# EAGLE design Schemat (EAGLE 9.6.0)
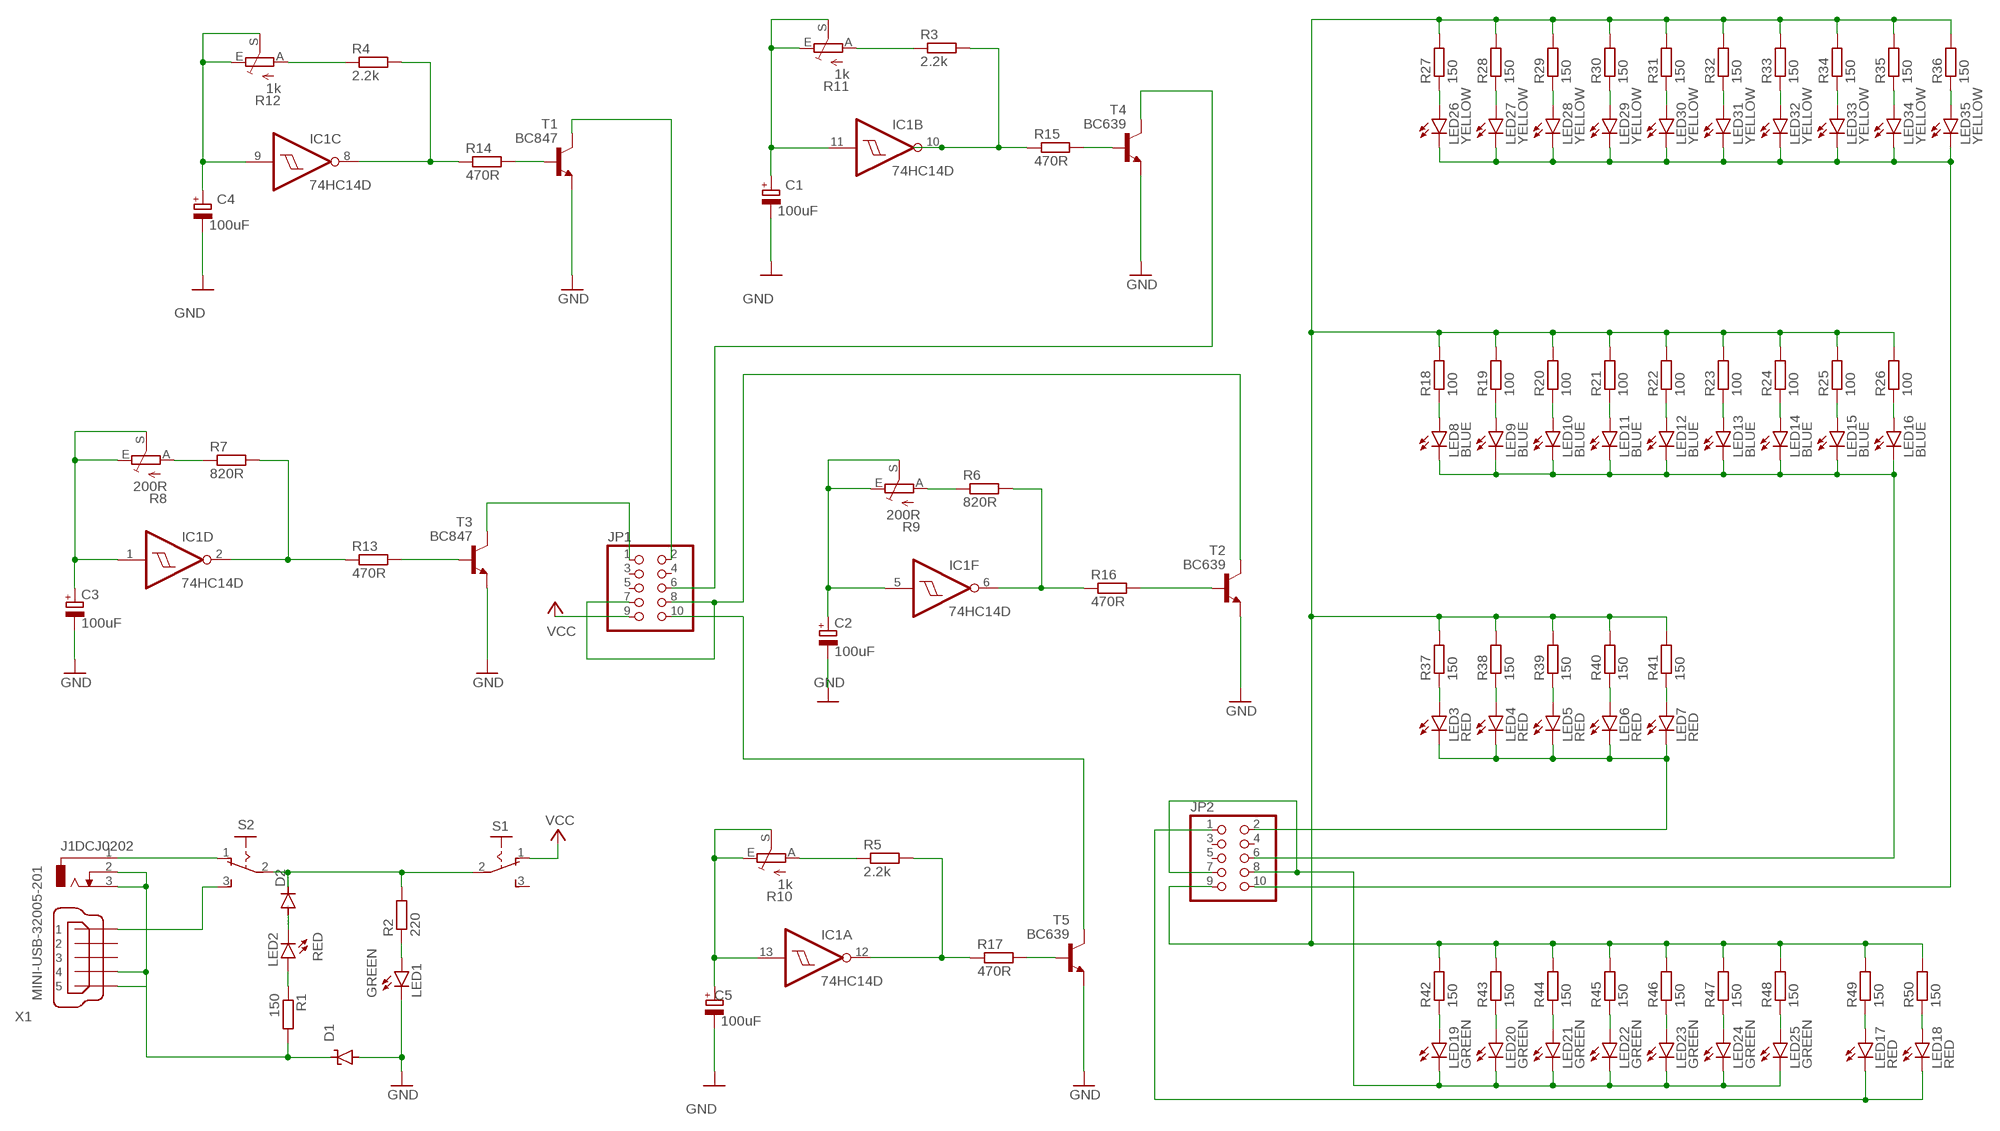
[diagram p0: schematic, sheet 1]

## Parts
C1  100uF  CPOL-EUE2.5-6  [E2,5-6]
C2  100uF  CPOL-EUE2.5-6  [E2,5-6]
C3  100uF  CPOL-EUE2.5-6  [E2,5-6]
C4  100uF  CPOL-EUE2.5-6  [E2,5-6]
C5  100uF  CPOL-EUE2.5-6  [E2,5-6]
D1  SUPPRESSOR-SMBJ  [SMBJ]
D2  DIODE-DO214AC  [DO214AC]
IC1  74HC14D  [SO14]
J1  DCJ0202  [DCJ0202]
JP1  PINHD-2X5  [2X05]
JP2  PINHD-2X5/90  [2X05/90]
LED1  GREEN  LED3MM  [LED3MM]
LED2  RED  LED5MM  [LED5MM]
LED3  RED  LED5MM  [LED5MM]
LED4  RED  LED5MM  [LED5MM]
LED5  RED  LED5MM  [LED5MM]
LED6  RED  LED5MM  [LED5MM]
LED7  RED  LED5MM  [LED5MM]
LED8  BLUE  LED5MM  [LED5MM]
LED9  BLUE  LED5MM  [LED5MM]
LED10  BLUE  LED5MM  [LED5MM]
LED11  BLUE  LED5MM  [LED5MM]
LED12  BLUE  LED5MM  [LED5MM]
LED13  BLUE  LED5MM  [LED5MM]
LED14  BLUE  LED5MM  [LED5MM]
LED15  BLUE  LED5MM  [LED5MM]
LED16  BLUE  LED5MM  [LED5MM]
LED17  RED  LED5MM  [LED5MM]
LED18  RED  LED5MM  [LED5MM]
LED19  GREEN  LED3MM  [LED3MM]
LED20  GREEN  LED3MM  [LED3MM]
LED21  GREEN  LED3MM  [LED3MM]
LED22  GREEN  LED3MM  [LED3MM]
LED23  GREEN  LED3MM  [LED3MM]
LED24  GREEN  LED3MM  [LED3MM]
LED25  GREEN  LED3MM  [LED3MM]
LED26  YELLOW  LED5MM  [LED5MM]
LED27  YELLOW  LED5MM  [LED5MM]
LED28  YELLOW  LED5MM  [LED5MM]
LED29  YELLOW  LED5MM  [LED5MM]
LED30  YELLOW  LED5MM  [LED5MM]
LED31  YELLOW  LED5MM  [LED5MM]
LED32  YELLOW  LED5MM  [LED5MM]
LED33  YELLOW  LED5MM  [LED5MM]
LED34  YELLOW  LED5MM  [LED5MM]
LED35  YELLOW  LED5MM  [LED5MM]
R1  150  R-EU_R0805  [R0805]
R2  220  R-EU_R0805  [R0805]
R3  2.2k  R-EU_R1206  [R1206]
R4  2.2k  R-EU_R1206  [R1206]
R5  2.2k  R-EU_R1206  [R1206]
R6  820R  R-EU_R1206  [R1206]
R7  820R  R-EU_R1206  [R1206]
R8  200R  TRIM_EU-CA6V  [CA6V]
R9  200R  TRIM_EU-CA6V  [CA6V]
R10  1k  TRIM_EU-CA6V  [CA6V]
R11  1k  TRIM_EU-CA6V  [CA6V]
R12  1k  TRIM_EU-CA6V  [CA6V]
R13  470R  R-EU_R1206  [R1206]
R14  470R  R-EU_R1206  [R1206]
R15  470R  R-EU_R1206  [R1206]
R16  470R  R-EU_R1206  [R1206]
R17  470R  R-EU_R1206  [R1206]
R18  100  R-EU_R0805  [R0805]
R19  100  R-EU_R0805  [R0805]
R20  100  R-EU_R0805  [R0805]
R21  100  R-EU_R0805  [R0805]
R22  100  R-EU_R0805  [R0805]
R23  100  R-EU_R0805  [R0805]
R24  100  R-EU_R0805  [R0805]
R25  100  R-EU_R0805  [R0805]
R26  100  R-EU_R0805  [R0805]
R27  150  R-EU_R0805  [R0805]
R28  150  R-EU_R0805  [R0805]
R29  150  R-EU_R0805  [R0805]
R30  150  R-EU_R0805  [R0805]
R31  150  R-EU_R0805  [R0805]
R32  150  R-EU_R0805  [R0805]
R33  150  R-EU_R0805  [R0805]
R34  150  R-EU_R0805  [R0805]
R35  150  R-EU_R0805  [R0805]
R36  150  R-EU_R0805  [R0805]
R37  150  R-EU_R0805  [R0805]
R38  150  R-EU_R0805  [R0805]
R39  150  R-EU_R0805  [R0805]
R40  150  R-EU_R0805  [R0805]
R41  150  R-EU_R0805  [R0805]
R42  150  R-EU_R0805  [R0805]
R43  150  R-EU_R0805  [R0805]
R44  150  R-EU_R0805  [R0805]
R45  150  R-EU_R0805  [R0805]
R46  150  R-EU_R0805  [R0805]
R47  150  R-EU_R0805  [R0805]
R48  150  R-EU_R0805  [R0805]
R49  150  R-EU_R0805  [R0805]
R50  150  R-EU_R0805  [R0805]
S1  M251  [M251]
S2  M251  [M251]
T1  BC847  [SOT23]
T2  BC639  BC639-NPN-TO92-ECB  [TO92-ECB]
T3  BC847  [SOT23]
T4  BC639  BC639-NPN-TO92-ECB  [TO92-ECB]
T5  BC639  BC639-NPN-TO92-ECB  [TO92-ECB]
X1  MINI-USB-32005-201  [32005-201]

## Nets
GND: C1.- C2.- C3.- C4.- C5.- D1.A LED1.K(C) T1.2(E) T2.E T3.2(E) T4.E T5.E
N$1: JP2.2 LED3.K(C) LED4.K(C) LED5.K(C) LED6.K(C) LED7.K(C)
N$2: JP2.6 LED8.K(C) LED9.K(C) LED10.K(C) LED11.K(C) LED12.K(C) LED13.K(C) LED14.K(C) LED15.K(C) LED16.K(C)
N$3: D2.A LED2.K(C)
N$4: LED2.A R1.1
N$5: JP2.9 R18.2 R19.2 R20.2 R21.2 R22.2 R23.2 R24.2 R25.2 R26.2 R27.2 R28.2 R29.2 R30.2 R31.2 R32.2 R33.2 R34.2 R35.2 R36.2 R37.2 R38.2 R39.2 R40.2 R41.2 R42.2 R43.2 R44.2 R45.2 R46.2 R47.2 R48.2 R49.2 R50.2
N$6: JP2.10 LED26.K(C) LED27.K(C) LED28.K(C) LED29.K(C) LED30.K(C) LED31.K(C) LED32.K(C) LED33.K(C) LED34.K(C) LED35.K(C)
N$7: JP2.1 LED17.K(C) LED18.K(C)
N$8: JP2.7 JP2.8 LED19.K(C) LED20.K(C) LED21.K(C) LED22.K(C) LED23.K(C) LED24.K(C) LED25.K(C)
N$9: LED3.A R37.1
N$10: LED21.A R44.1
N$11: LED22.A R45.1
N$12: LED23.A R46.1
N$13: LED24.A R47.1
N$14: LED25.A R48.1
N$15: LED19.A R42.1
N$16: LED20.A R43.1
N$18: LED7.A R41.1
N$19: LED6.A R40.1
N$20: LED5.A R39.1
N$21: LED4.A R38.1
N$22: D1.C J1.2 J1.3 R1.2 X1.4 X1.5
N$23: LED8.A R18.1
N$24: LED9.A R19.1
N$25: LED10.A R20.1
N$26: LED11.A R21.1
N$27: LED12.A R22.1
N$28: LED13.A R23.1
N$29: LED14.A R24.1
N$30: LED15.A R25.1
N$31: LED16.A R26.1
N$32: JP1.2 T1.3(C)
N$33: LED18.A R50.1
N$34: LED17.A R49.1
N$35: D2.C R2.2 S1.2(P) S2.2(P)
N$36: LED27.A R28.1
N$37: LED28.A R29.1
N$38: LED29.A R30.1
N$39: LED30.A R31.1
N$40: LED31.A R32.1
N$41: LED32.A R33.1
N$42: LED33.A R34.1
N$43: LED34.A R35.1
N$44: LED35.A R36.1
N$46: LED26.A R27.1
N$47: C1.+ IC1.11(B:I) R11.E R11.S
N$48: R3.1 R11.A
N$49: C4.+ IC1.9(C:I) R12.E R12.S
N$50: R15.2 T4.B
N$51: IC1.10(B:O) R3.2 R15.1
N$52: R4.1 R12.A
N$53: R14.2 T1.1(B)
N$54: IC1.8(C:O) R4.2 R14.1
N$55: C5.+ IC1.13(A:I) R10.E R10.S
N$56: R5.1 R10.A
N$57: R17.2 T5.B
N$58: IC1.12(A:O) R5.2 R17.1
N$59: R6.1 R9.A
N$60: R7.1 R8.A
N$61: IC1.2(D:O) R7.2 R13.1
N$62: R13.2 T3.1(B)
N$63: C3.+ IC1.1(D:I) R8.E R8.S
N$64: IC1.6(F:O) R6.2 R16.1
N$65: R16.2 T2.B
N$66: C2.+ IC1.5(F:I) R9.E R9.S
N$67: LED1.A R2.1
N$68: JP1.10 T5.C
N$69: J1.1 S2.1(O)
N$71: S2.3(S) X1.1
N$74: JP1.6 T4.C
N$77: JP1.1 T3.3(C)
N$83: JP1.7 JP1.8 T2.C
VCC: JP1.9 S1.1(O)
Unconnected: IC1.3(E:I) IC1.4(E:O) JP1.3 JP1.4 JP1.5 JP2.3 JP2.4 JP2.5 S1.3(S) X1.2 X1.3

## Power pins joined to a net without a drawn wire
GND: IC1.7(P:GND)
VCC: IC1.14(P:VCC)

## Library data of the parts
C1-C5 = rcl:CPOL-EU: POLARIZED CAPACITOR, European symbol; SPICEPREFIX: C
D1 = diode:SUPPRESSOR-: Suppressor diode
D2 = diode:DIODE-: DIODE
IC1 = 74xx-eu:74*14: Hex schmitt trigger INVERTER
J1 = con-jack:DCJ0202: DC POWER JACK Source: DCJ0202.pdf; OC_FARNELL: unknown; OC_NEWARK: unknown
JP1 JP2 = pinhead:PINHD-2X5: PIN HEADER
LED1-LED35 = led:LED: LED OSRAM: - CHIPLED LG R971, LG N971, LY N971, LG Q971, LY Q971, LO R971, LY R971 LH N974, LH R974 LS Q976, LO Q976, LY Q976 LO Q996 - Hyper CHIPLED LW Q18S LB Q993, LB Q99A, LB R99A - SideLED LS A670, LO A670, LY A670, LG A670, LP A670 LB A673, LV A673, LT A673, LW A673 LH A674 LY A675 LS A676, LA A676, LO A676, LY A676, LW A676 LS A679, LY A679, LG A679 - Hyper Micro SIDELED® LS Y876, LA Y876, LO Y876, LY Y876 LT Y87S - SmartLED LW L88C, LW L88S LB L89C, LB L89S, LG L890 LS L89K, LO L89K, LY L89K LS L896, LA L896, LO L896, LY L896 - TOPLED LS T670, LO T670, LY T670, LG T670, LP T670 LSG T670, LSP T670, LSY T670, LOP T670, LYG T670 LG T671, LOG T671, LSG T671 LB T673, LV T673, LT T673, LW T673 LH T674 LS T676, LA T676, LO T676, LY T676, LB T676, LH T676, LSB T676, LW T676 LB T67C, LV T67C, LT T67C, LS T67K, LO T67K, LY T67K, LW E67C LS E67B, LA E67B, LO E67B, LY E67B, LB E67C, LV E67C, LT E67C LW T67C LS T679, LY T679, LG T679 LS T770, LO T770, LY T770, LG T770, LP T770 LB T773, LV T773, LT T773, LW T773 LH T774 LS E675, LA E675, LY E675, LS T675 LS T776, LA T776, LO T776, LY T776, LB T776 LHGB T686 LT T68C, LB T68C - Hyper Mini TOPLED® LB M676 - Mini TOPLED Santana® LG M470 LS M47K, LO M47K, LY M47K Source: http://www.osram.convergy.de LUXEON: - LUMILED® LXK2-PW12-R00, LXK2-PW12-S00, LXK2-PW14-U00, LXK2-PW14-V00 LXK2-PM12-R00, LXK2-PM12-S00, LXK2-PM14-U00 LXK2-PE12-Q00, LXK2-PE12-R00, LXK2-PE12-S00, LXK2-PE14-T00, LXK2-PE14-U00 LXK2-PB12-K00, LXK2-PB12-L00, LXK2-PB12-M00, LXK2-PB14-N00, LXK2-PB14-P00, LXK2-PB14-Q00 LXK2-PR12-L00, LXK2-PR12-M00, LXK2-PR14-Q00, LXK2-PR14-R00 LXK2-PD12-Q00, LXK2-PD12-R00, LXK2-PD12-S00 LXK2-PH12-R00, LXK2-PH12-S00 LXK2-PL12-P00, LXK2-PL12-Q00, LXK2-PL12-R00 Source: www.luxeon.com KINGBRIGHT: KA-3528ASYC Source: www.kingbright.com
R1-R7 R13-R50 = rcl:R-EU_: RESISTOR, European symbol; SPICEPREFIX: R
R8-R12 = pot:TRIM_EU-: POTENTIOMETER
S1 S2 = switch:M251: SLIDING SWITCH Mors, distributor Buerklin, 11G702
T1 T3 = transistor:BC847: NPN TRANSISTOR
T2 T4 T5 = transistor:*-NPN-: NPN Transistror BF959 corrected 2008.03.06
X1 = con-cypressindustries:MINI-USB-: MINI USB-B Conector Source: www.cypressindustries.com; OC_FARNELL: unknown; OC_NEWARK: unknown

## Board
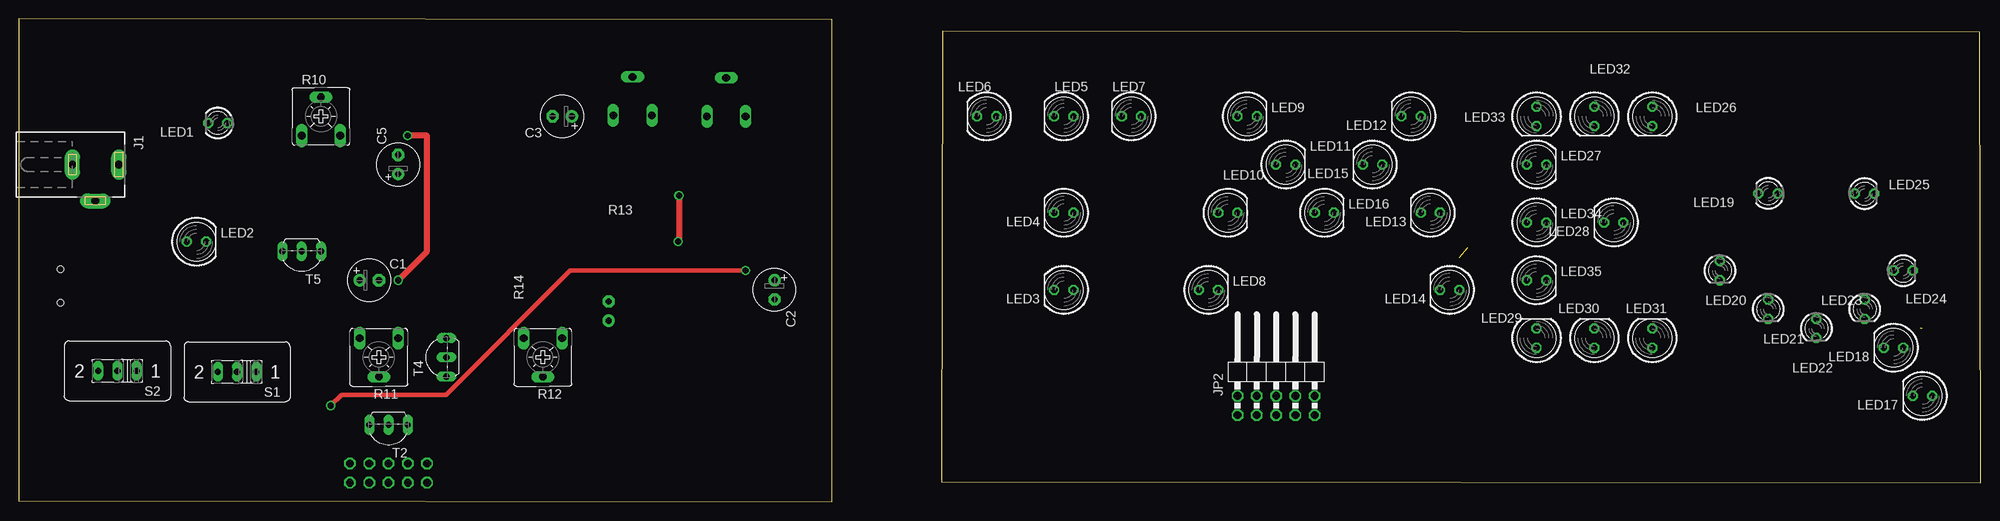
[diagram p1: board, top side]
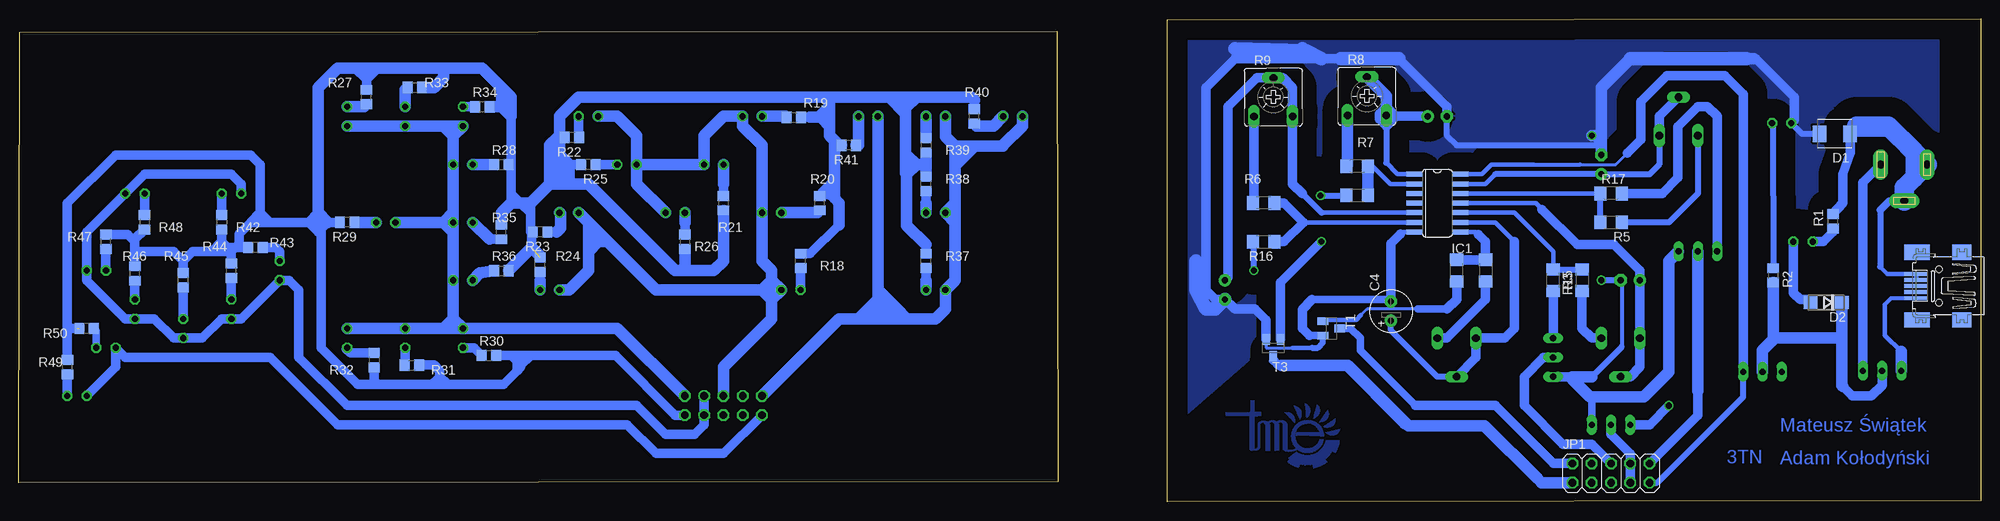
[diagram p2: board, bottom side, seen from below]

Size 258.21 x 63.63 mm. Coordinates in mm from the lower left corner, seen from the top.
Outline: 121.41,2.67 258.21,2.54 258.08,61.9 121.54,62.03 121.41,2.67
Outline: 0,63.63 0,0.13 107.06,0 107.06,63.5 0,63.63
Copper layers (1*16): Top 0.035mm / dielectric 1.5mm / Bottom 0.035mm
Design rules "default": minimum track width 6mil, minimum drill 0.35mm, track to track 6mil, track to pad 6mil, pad to pad 6mil, via to via 6mil, smd to smd 6mil, copper to edge 40mil, drill to drill 6mil, minimum pad ring 10mil, minimum via ring 8mil, stop-mask expansion 4mil, vias tented up to drill 0mil, thermal gap 10mil

### Footprints (pad centres in the part's own frame; a part is rotated, then mirrored left to right if it is on the bottom)
E2,5-6 = drill 0.813 pad 1.6: + -1.27,0 | drill 0.813 pad 1.6 octagon: - 1.27,0
SMBJ = smd 1.78 x 2.16: A 2.04,0; C -2.03,0
DO214AC = smd 1.8 x 1.7: A 2.05,0; C -2.05,0
SO14 = smd 0.66 x 2.032: 1 -3.81,-3.073; 2 -2.54,-3.073; 3 -1.27,-3.073; 4 0,-3.073; 5 1.27,-3.073; 6 2.54,-3.073; 7 3.81,-3.073; 8 3.81,3.073; 9 2.54,3.073; 10 1.27,3.073; 11 0,3.073; 12 -1.27,3.073; 13 -2.54,3.073; 14 -3.81,3.073
DCJ0202 = drill 1 pad 2 long: 1 0,3.1; 2 4.8,0; 3 0,-3
2X05 = drill 1.016 octagon: 1 -5.08,-1.27; 2 -5.08,1.27; 3 -2.54,-1.27; 4 -2.54,1.27; 5 0,-1.27; 6 0,1.27; 7 2.54,-1.27; 8 2.54,1.27; 9 5.08,-1.27; 10 5.08,1.27
2X05/90 = drill 1.016 octagon: 1 -5.08,-6.35; 2 -5.08,-3.81; 3 -2.54,-6.35; 4 -2.54,-3.81; 5 0,-6.35; 6 0,-3.81; 7 2.54,-6.35; 8 2.54,-3.81; 9 5.08,-6.35; 10 5.08,-3.81
LED3MM = drill 0.813 octagon: A -1.27,0; K 1.27,0
LED5MM = drill 0.813 octagon: A -1.27,0; K 1.27,0
R0805 = smd 1.3 x 1.5: 1 -0.95,0; 2 0.95,0
R1206 = smd 1.6 x 1.803: 1 -1.422,0; 2 1.422,0
CA6V = drill 1.016 long: A -2.54,-2.54; E 2.54,-2.54; S 0,2.54
M251 = drill 0.813 long: 1 -2.54,0; 2 0,0; 3 2.54,0
SOT23 = smd 1 x 1.4: 1 -0.95,-1.1; 2 0.95,-1.1; 3 0,1.1
TO92-ECB = drill 0.813 long: B 2.54,0; C 0,0; E -2.54,0
32005-201 = smd 3.1 x 0.5: 1 3,1.6; 2 3,0.8; 3 3,0; 4 3,-0.8; 5 3,-1.6 | smd 2.5 x 2: M1 -3,-4.45; M2 -3,4.45 | smd 3.3 x 2: M3 2.9,4.45; M4 2.9,-4.45 | hole 0.9: 0,2.2; 0,-2.2

### Placement (x,y rotation side)
C1  46.1,29.21 0 top
C2  99.44,27.94 270 top
C3  71.5,50.8 180 top
C4  77.6,25.15 90 bottom
C5  49.91,44.45 90 top
D1  19.18,48.51 180 bottom
D2  20.32,26.29 180 bottom
IC1  71.5,39.37 270 bottom
J1  10.03,44.45 270 top
JP1  48.64,3.81 0 bottom
JP2  165.48,17.78 0 top
LED1  26.16,49.91 180 top
LED2  23.37,34.29 0 top
LED3  137.54,27.94 180 top
LED4  137.54,38.1 180 top
LED5  137.54,50.8 180 top
LED6  127.38,50.8 180 top
LED7  146.43,50.8 180 top
LED8  156.59,27.94 0 top
LED9  161.67,50.8 0 top
LED10  159.13,38.1 0 top
LED11  166.75,44.45 0 top
LED12  183.26,50.8 180 top
LED13  185.8,38.1 180 top
LED14  188.34,27.94 180 top
LED15  178.18,44.45 180 top
LED16  171.83,38.1 0 top
LED17  250.57,13.97 180 top
LED18  246.76,20.32 180 top
LED19  230.25,40.64 180 top
LED20  223.9,30.48 270 top
LED21  230.25,25.4 270 top
LED22  236.6,22.86 270 top
LED23  242.95,25.4 270 top
LED24  248.03,30.48 0 top
LED25  242.95,40.64 0 top
LED26  215.01,50.8 270 top
LED27  199.77,44.45 0 top
LED28  209.93,36.83 180 top
LED29  199.77,21.59 90 top
LED30  207.39,21.59 90 top
LED31  215.01,21.59 90 top
LED32  207.39,50.8 270 top
LED33  199.77,50.8 270 top
LED34  199.77,36.83 0 top
LED35  199.77,29.21 0 top
R1  19.43,36.96 90 bottom
R2  27.31,29.84 270 bottom
R3  52.45,29.21 90 bottom
R4  65.15,30.48 90 bottom
R5  48.64,36.83 180 bottom
R6  94.36,39.37 0 bottom
R7  82.04,44.2 0 bottom
R8  80.77,53.47 0 bottom
R9  93.09,53.34 0 bottom
R10  39.75,50.8 0 top
R11  47.37,19.05 180 top
R12  68.96,19.05 180 top
R13  82.04,40.39 180 bottom
R14  68.96,30.48 270 bottom
R15  56.26,29.21 270 bottom
R16  94.36,34.29 180 bottom
R17  48.64,40.64 0 bottom
R18  155.32,31.75 90 bottom
R19  156.21,50.67 0 bottom
R20  152.78,39.37 90 bottom
R21  165.48,39.37 270 bottom
R22  185.42,48.01 180 bottom
R23  189.61,35.56 180 bottom
R24  189.61,31.24 90 bottom
R25  183.26,44.45 180 bottom
R26  170.56,34.29 270 bottom
R27  212.47,53.34 90 bottom
R28  194.69,44.45 0 bottom
R29  215.01,36.83 180 bottom
R30  196.34,19.3 0 bottom
R31  206.5,18.03 0 bottom
R32  211.45,18.67 270 bottom
R33  206.12,54.61 0 bottom
R34  197.23,52.07 0 bottom
R35  194.69,35.56 90 bottom
R36  194.69,30.48 0 bottom
R37  138.81,31.75 90 bottom
R38  138.81,41.91 90 bottom
R39  138.81,46.99 270 bottom
R40  132.46,50.8 90 bottom
R41  148.97,46.99 180 bottom
R42  231.52,36.83 270 bottom
R43  227.08,33.53 180 bottom
R44  230.25,30.48 90 bottom
R45  236.6,29.21 90 bottom
R46  242.95,30.1 90 bottom
R47  246.76,34.29 90 bottom
R48  241.68,36.83 270 bottom
R49  251.84,17.78 90 bottom
R50  249.3,22.86 180 bottom
S1  28.7,17.14 180 top
S2  12.95,17.27 180 top
T1  85.47,22.86 270 bottom
T2  48.64,10.16 180 top
T3  93.09,20.32 180 bottom
T4  56.26,19.05 90 top
T5  37.21,33.02 180 top
X1  5.46,28.45 180 bottom

### Tracks (layer width: path | path; a pad name or v marks a point on that pad's centre or on a via)
GND  (via drill 0.8)
  Top 0.813: v49.91,29.21 53.72,33.02 53.72,48.26 v51.18,48.26
  Bottom 0.406: T3.2 94.04,20.32 90.55,20.32
  Bottom 0.508: C1.- 47.24,29.08 47.24,20.45
  Bottom 0.61: 76.34,35.32 76.1,35.56 IC1.7 | 90.55,20.32 88.01,20.32
  Bottom 0.813: 49.91,46.99 68.96,46.99 70.23,48.26 C3.- | 51.18,16.51 47.24,20.45 | 41.02,20.32 41.02,19.81 | C1.- v49.91,29.21 | v51.18,48.26 49.91,46.99 | 49.91,46.99 C5.- | LED1.K 23.5,48.51 D1.A | 88.01,20.32 87.25,20.32 86.57,21 T1.2
  Bottom 1.016: T2.E 51.18,13.84 | 77.85,26.67 88,26.67 | 88.33,21.91 T1.2
  Bottom 1.27: T3.2 94.04,23.96 95.48,25.4 98.17,25.4 C2.- 100.71,26.67 101.98,27.94 101.98,54.61 98.17,58.42 86.74,58.42 84.2,58.42 | C3.- 70.23,52.07 76.58,58.42 | 76.34,35.32 77.6,34.06 C4.- 77.85,26.67 | 30.86,58.42 29.59,58.42 24.51,53.34 24.51,50.29 LED1.K | 88,26.67 89.28,25.39 89.28,22.86 88.33,21.91 | T4.E 53.72,16.51
  Bottom 1.524: 51.18,16.51 53.72,16.51 53.72,16.13 51.43,13.84 51.18,13.84 44.32,13.84 41.02,17.14 41.02,19.81 | T5.E 41.02,31.75 41.02,20.32 | 29.84,58.42 30.86,58.42 | 46.1,58.42 49.91,54.61 49.91,48.26 | 49.91,48.26 C5.- | 49.91,48.26 v51.18,48.26
  Bottom 1.778: 46.1,58.42 30.86,58.42 | 76.58,58.42 84.2,58.42 | 86.74,58.42 88.77,59.44 | 88.77,59.44 89.28,59.69 | 88.77,59.44 98.17,59.69 | C2.- 100.71,25.4 101.98,25.4 103.25,27.94 103.25,31.75
  pour Bottom (isolate 2.54): 19.43,52.07 9.27,52.07 5.46,48.26 5.46,60.96 104.52,60.96 104.52,11.43 94.36,20.32 94.36,27.94 100.71,27.94 100.71,46.99 19.43,38.1 18.16,50.8
N$1
  Bottom 1.524: LED7.K 145.16,27.94 | 135,46.85 135,44.45 | 135,44.45 135,39.37 | 135,39.37 LED4.K 135,36.83 | LED6.K 126.11,49.53 128.65,46.99 | 128.65,46.99 128.65,46.85 | 128.65,46.99 128.79,46.85 132.46,46.85 | 132.46,46.85 135,46.85 | 135,36.83 135,29.21 LED3.K 136.27,25.4 137.54,24.13 141.35,24.13 | 141.35,24.13 142.62,25.4 | 142.62,25.4 143.89,26.67 | 143.89,26.67 145.16,27.94 | 135,36.83 135,39.37 | 135,46.85 136.27,48.12 LED5.K | 132.46,46.85 134.86,44.45 135,44.45 | JP2.2 150.24,24.13 147.7,24.13 | 147.7,24.13 145.16,24.13 | 145.16,24.13 141.35,24.13 | 145.16,27.94 145.16,26.67 147.7,24.13 | 143.89,26.67 145.16,25.4 145.16,24.13 | 142.62,25.4 143.89,25.4 145.16,24.13
N$2
  Bottom 1.524: LED16.K 176.91,41.91 LED15.K | LED12.K 179.45,50.8 176.91,48.26 LED15.K | LED15.K LED11.K 168.02,48.26 165.48,50.8 LED9.K 162.94,49.53 160.4,46.99 LED10.K 160.4,31.75 159.13,30.48 159.13,29.21 | LED8.K 159.13,29.21 | LED8.K 159.13,27.94 | 159.13,27.94 160.4,27.94 | 160.4,27.94 174.37,27.94 180.72,34.29 | 159.13,29.21 160.4,27.94 | 180.72,34.29 183.26,36.83 | 183.26,36.83 LED13.K | 183.26,34.29 183.26,33.02 | LED14.K 185.8,27.94 183.26,30.48 183.26,33.02 | 183.26,34.29 181.99,34.29 | 181.99,34.29 180.72,34.29 | 181.99,34.29 183.26,33.02 | 183.26,34.29 183.26,36.83 | 159.13,27.94 159.13,26.67 | 159.13,26.67 159.13,24.13 165.48,17.78 JP2.6 | 160.4,27.94 159.13,26.67 | LED8.K 159.13,26.67
N$3
  Bottom 1.27: D2.A 22.75,26.67 23.75,26.67 24.64,27.56 LED2.K
N$4
  Bottom 1.27: LED2.A 20.7,34.29 19.43,35.56 R1.1
N$5  (2 unrouted)
  Bottom 0.61: 208.66,57.15 204.85,57.15 | 204.85,57.15 204.7,57 | 204.85,57.15 202.31,57.15 | 230.65,31.5 R44.2
  Bottom 1.27: R35.2 194.69,38.1 | 190.88,38.1 190.88,35.56 R23.2 190.75,35.37 190.75,33.53 | 190.88,38.1 190.88,39.37 | 190.88,38.1 192.15,39.37 193.42,40.64 | R25.2 185.8,44.45 | R22.2 187.32,48.01 | R40.2 132.46,52.96 | R39.2 138.81,45.72 | R38.2 138.81,43.18 | R37.2 138.81,33.91 | R20.2 152.46,40.64 | R19.2 154.05,50.67 | R26.2 170.56,33.02 | R24.2 189.61,32.38 | 193.42,50.8 193.42,44.45 R28.2 193.42,44.13 193.42,40.64 | 193.42,40.64 193.42,39.37 | R33.2 204.85,54.61 | R34.2 195.96,52.07 | R27.2 212.47,55.88 | 217.55,36.83 R29.2 | 203.58,15.49 202.82,15.49 | 202.82,15.49 202.31,15.49 | 202.31,15.49 201.8,15.49 | R31.2 203.58,18.03 202.82,17.27 202.82,16.51 | 202.82,16 202.82,15.49 | 202.82,16.51 203.58,15.75 203.58,15.49 | 202.82,16 202.82,16.51 | 202.82,16 202.31,15.49 | 202.82,16.51 201.8,15.49 | 192.66,17.27 194.44,15.49 201.8,15.49 | 192.66,17.27 192.15,17.78 192.15,18.03 | 192.15,18.03 192.15,19.05 192.41,19.3 | R30.2 193.42,19.3 | 193.42,19.3 192.41,19.3 | 192.41,19.3 190.88,19.3 | 192.15,18.03 192.66,18.54 | 193.42,19.3 192.66,18.54 | 192.66,17.27 192.66,18.54 | 190.88,19.3 192.15,18.03 | JP2.9 171.83,11.43 179.7,19.3 190.88,19.3 | R46.2 242.95,33.02 | 242.95,33.02 242.95,34.29 | R45.2 236.6,31.75 | 236.6,31.75 237.87,33.02 242.95,33.02 | 236.6,31.75 235.33,33.02 232.79,33.02 | 232.79,33.02 231.52,34.29 | 231.52,34.29 R42.2 | 231.52,34.29 230.76,33.53 | 230.76,33.53 230.25,33.02 | 230.25,33.02 R44.2 | 230.25,33.02 232.79,33.02 | R43.2 229.74,33.53 | 230.76,33.53 229.74,33.53 | 229.74,33.53 230.25,33.02 | R47.2 243.9,35.24 242.95,34.29 | R49.2 251.84,22.86 | 251.84,22.86 250.57,22.86 | 251.84,22.86 251.84,39.37 245.49,45.72 227.71,45.72 226.44,44.45 226.44,38.1
  Bottom 1.27: 217.55,36.83 218.44,36.83 | 218.44,36.83 220.09,36.83 | 220.09,36.83 225.17,36.83 | 225.17,36.83 227.71,36.83 | 227.71,36.83 229.23,35.31 229.23,34.04 229.74,33.53 | 226.44,38.1 227.71,36.83 | 226.44,38.1 225.17,36.83 | R32.2 211.45,16 210.95,15.49 | 210.95,15.49 203.58,15.49 | 210.95,15.49 213.61,15.49 218.44,20.32 218.44,35.56 | 218.44,35.56 218.44,36.83 | 218.82,38.1 220.09,36.83 | 220.09,36.83 218.82,35.56 | 218.82,35.56 218.44,35.56 | 218.82,35.56 217.55,36.83 | R18.2 154.05,32.7 150.24,36.51 | 242.95,34.29 242.95,34.61 R48.2
  Bottom 1.524: 150.88,40.01 150.24,39.37 150.24,36.51 | 150.88,40.01 151.51,40.64 152.46,40.64 151.19,41.91 150.88,41.91 | 170.56,33.02 170.56,30.48 | 170.56,30.48 166.75,30.48 165.48,31.75 R21.2 | 170.56,30.48 171.83,30.48 183.22,41.87 185.8,41.87 | 185.8,41.87 188.3,41.87 | 187.07,48.26 187.32,48.01 188.34,46.99 | 188.34,46.99 188.34,44.45 | 188.34,44.45 188.34,41.91 188.3,41.87 | 187.07,44.45 185.8,44.45 | 187.07,44.45 188.34,44.45 | 187.07,44.45 187.07,43.18 185.8,43.18 | 185.8,43.18 185.8,41.87 | 185.8,43.18 185.8,44.45 | 185.8,44.45 187.07,45.72 | 187.07,45.72 187.71,46.35 | 187.71,46.35 188.34,46.99 | 187.07,46.99 187.07,48.26 | 187.71,46.35 187.07,46.99 | 187.07,45.72 187.07,46.99 | 188.3,41.87 188.38,41.87 190.88,39.37 192.15,39.37 193.42,39.37 194.69,38.1 | 189.61,32.38 190.72,33.5 R36.2 | 204.85,54.61 203.58,54.61 202.31,55.88 202.31,57.15 | 202.31,57.15 208.66,57.15 211.2,57.15 | 194.69,54.61 197.23,57.15 202.31,57.15 | 194.69,54.61 193.42,53.34 193.42,52.07 | 193.42,52.07 193.42,50.8 194.69,52.07 | 193.42,52.07 194.69,52.07 | 195.96,52.07 194.69,52.07 | 194.69,52.07 194.69,54.61 | 187.07,48.26 187.07,50.8 184.53,53.34 151.51,53.34 | 154.05,50.67 152.91,50.67 | 151.51,53.34 151.51,52.07 | 152.91,50.67 151.51,52.07 | R41.2 150.24,46.99 150.88,47.62 | 150.88,47.62 151.51,48.26 151.51,49.53 | 151.51,52.07 151.51,49.53 | 152.91,50.67 152.65,50.67 151.51,49.53 | 150.88,47.62 150.88,41.91 | 150.88,41.91 150.88,40.01 | 151.51,53.34 143.64,53.34 | 138.81,45.72 138.81,44.45 | 138.81,43.18 138.81,44.45 | 141.48,51.18 143.64,53.34 | 141.48,51.18 141.48,51.94 140.08,53.34 | 143.64,53.34 140.08,53.34 | 140.08,53.34 132.84,53.34 132.46,52.96
  Bottom 1.524: 141.35,43.18 140.08,44.45 | 141.35,43.18 141.48,43.31 141.48,45.72 | 141.48,45.72 141.48,51.18 | 138.81,44.45 140.08,44.45 | 140.08,44.45 141.35,45.72 141.48,45.72 | 141.35,43.18 141.35,36.45 138.81,33.91 | 217.55,36.83 218.82,38.1 218.82,54.61 216.28,57.15 213.74,57.15 | 213.74,57.15 212.47,57.15 | 212.47,57.15 211.2,57.15 | 212.47,57.15 212.47,55.88 | 212.47,55.88 213.74,57.15 | 212.47,55.88 211.2,57.15
N$6
  Bottom 0.61: LED29.K 201.04,22.86 202.31,22.86 LED30.K
  Bottom 1.524: 202.31,49.53 LED33.K 201.04,48.26 | 202.31,49.53 LED32.K LED26.K | 201.04,48.26 LED27.K 201.04,38.1 | 201.04,48.26 202.31,49.53 | 201.04,38.1 LED34.K | LED34.K 201.04,35.56 | 201.04,35.56 LED35.K 201.04,24.13 | LED28.K 202.31,36.83 | LED34.K 202.31,36.83 | 201.04,38.1 202.31,36.83 | 202.31,36.83 201.04,35.56 | 201.04,22.86 201.04,24.13 | LED29.K 201.04,24.13 | 201.04,24.13 202.31,22.86 | LED29.K LED30.K LED31.K | JP2.10 179.45,22.86 LED29.K
N$7
  Bottom 1.27: LED17.K 245.49,17.78 LED18.K 244.22,19.05 225.17,19.05 216.28,10.16 178.13,10.16 174.37,6.4 165.43,6.4 JP2.1
N$8
  Bottom 1.27: LED19.K 228.98,41.91 230.25,43.18 241.68,43.18 LED25.K 249.3,35.56 LED24.K 249.3,29.21 244.22,24.13 LED23.K 240.41,24.13 237.87,21.59 LED22.K 234.06,21.59 231.52,24.13 LED21.K 228.98,24.13 LED20.K 222.63,29.21 221.36,27.94 221.36,19.05 215.01,12.7 176.91,12.7 173.1,8.89 169.29,8.89 168.02,10.16 JP2.7 JP2.8
N$9
  Bottom 1.27: R37.1 138.81,29.21
  Bottom 1.524: 138.81,29.21 LED3.A
N$10
  Bottom 1.27: R44.1 LED21.A
N$11
  Bottom 1.27: R45.1 LED22.A
N$12
  Bottom 1.27: R46.1 LED23.A
N$13
  Bottom 1.27: R47.1 LED24.A
N$14
  Bottom 1.27: LED25.A R48.1
N$15
  Bottom 1.27: R42.1 LED19.A
N$16
  Bottom 1.27: R43.1 224.41,33.53 223.9,33.02 LED20.A
N$17
  pour Bottom (isolate 2.54): 1197 corners
N$18
  Bottom 1.524: LED7.A 147.7,46.99 R41.1
N$19
  Bottom 1.27: R40.1 132.14,49.53
  Bottom 1.524: 132.14,49.53 129.92,49.53 LED6.A
N$20
  Bottom 1.27: R39.1 138.81,48.26
  Bottom 1.524: 138.81,48.26 LED5.A
N$21
  Bottom 0.61: LED4.A 138.81,37.95
  Bottom 1.27: R38.1 138.81,39.37
  Bottom 1.524: 138.81,39.37 LED4.A
N$22
  Bottom 0.508: 13.21,30.99 12.27,30.05
  Bottom 0.61: 12.27,30.05 X1.5 X1.4
  Bottom 0.813: D1.C 12.37,48.51 8.3,44.45 J1.3 | 13.21,38.48 13.21,30.99
  Bottom 1.016: J1.2 12.04,39.65 13.21,38.48
  Bottom 1.27: R1.2 18.16,39.37 18.16,43.18 17.15,45.97 D1.C | 8.79,46.2 9.27,45.72 9.27,43.18 8.79,42.7
  Bottom 2.54: 16.26,49.53 12.11,49.53 8.79,46.2 J1.3 8.79,42.7 10.03,41.45 J1.2
N$23
  Bottom 1.27: R18.1 LED8.A
N$24
  Bottom 1.27: R19.1 157.29,50.8
  Bottom 1.524: 157.29,50.8 LED9.A
N$25
  Bottom 1.27: R20.1 153.1,38.1
  Bottom 1.524: 153.1,38.1 LED10.A
N$26
  Bottom 1.27: R21.1 165.48,41.91
  Bottom 1.524: LED11.A 165.48,41.91
N$27
  Bottom 1.27: LED12.A 184.53,48.07 R22.1
N$28
  Bottom 1.27: R23.1 187.45,35.56
  Bottom 1.524: 187.45,35.56 186.94,36.07 186.94,37.97 LED13.A
N$29
  Bottom 1.27: R24.1 189.61,29.21
  Bottom 1.524: 189.61,29.21 LED14.A
N$30
  Bottom 1.27: R25.1 LED15.A
N$31
  Bottom 1.27: R26.1 170.56,36.83
  Bottom 1.524: 170.56,36.83 LED16.A
N$32
  Bottom 1.016: 74.42,12.7 81.66,19.94 81.66,21.59 82.93,22.86 T1.3
  Bottom 1.27: 74.42,12.7 63.88,12.7 56.26,5.08 JP1.2
N$33
  Bottom 1.016: LED18.A 248.03,22.54 R50.1
N$34
  Bottom 1.27: R49.1 LED17.A
N$35
  Bottom 0.508: 17.53,14.61 16.89,13.97
  Bottom 0.61: D2.C 18.29,26.27 | 18.14,15.22 17.53,14.61 17.4,14.48
  Bottom 0.813: D2.C 18.14,26.16 | 28.68,17.14 S1.2 28.89,17.34
  Bottom 1.27: S2.2 12.95,15.37 14.35,13.97 16.89,13.97 18.14,15.22
  Bottom 1.524: 18.14,15.22 18.27,15.35 18.27,21.59 | 18.27,21.59 D2.C | S1.2 28.7,19.94 27.05,21.59 | 18.27,21.59 27.05,21.59 | 27.05,21.59 27.31,21.84 R2.2
N$36
  Bottom 1.27: R28.1 195.96,44.45
  Bottom 1.524: 195.96,44.45 LED27.A
N$37
  Bottom 1.27: R29.1 213.74,36.83
  Bottom 1.524: 213.74,36.83 LED28.A
N$38
  Bottom 1.27: LED29.A 198.31,20.32 R30.1
N$39
  Bottom 1.27: R31.1 207.39,18.09 LED30.A
N$40
  Bottom 1.27: LED31.A 215.14,20.19 214.56,19.62 R32.1
N$41
  Bottom 0.61: LED32.A 207.54,52.22
  Bottom 1.27: R33.1 207.39,54.29
  Bottom 1.524: 207.39,54.29 LED32.A
N$42
  Bottom 0.61: LED33.A 199.92,52.22
  Bottom 1.27: R34.1 LED33.A
N$43
  Bottom 1.27: R35.1 196.28,34.61
  Bottom 1.524: 196.28,34.61 LED34.A
N$44
  Bottom 1.27: R36.1 195.9,30.48 195.95,30.43
  Bottom 1.524: 195.95,30.43 197.55,30.16 LED35.A
N$46
  Bottom 0.61: LED26.A 215.16,52.22
  Bottom 1.27: R27.1 212.79,52.07
  Bottom 1.524: 212.79,52.07 LED26.A
N$47
  Bottom 0.61: 57.72,38.54 58.55,39.37 IC1.11
  Bottom 1.27: 57.72,38.54 53.09,33.91 48.26,33.91 44.83,30.48 C1.+ R11.E 44.83,17.78 46.1,16.51 R11.S
N$48
  Bottom 1.27: R11.A 51.18,21.59 52.45,22.86 R3.1
N$49
  Bottom 0.61: 61.34,34.29 63.88,36.83 IC1.9
  Bottom 0.813: R12.S 71.5,16.51 77.6,22.61 C4.+
  Bottom 1.27: R12.S 66.42,19.05 R12.E 62.61,21.59 61.34,22.86 61.34,34.29
N$50
  Bottom 1.27: T4.B R15.2
N$51
  Bottom 0.61: R15.1 56.26,33.02 61.34,38.1 IC1.10
  Bottom 0.813: R15.1 R3.2
N$52
  Bottom 1.27: R12.A 70.23,21.59 65.15,26.67 R4.1
N$53
  Bottom 0.406: 81.53,24.64 80.77,25.4 74.04,25.4
  Bottom 0.61: T1.1 86.38,24 82.17,24 81.53,24.64
  Bottom 1.016: 70.23,25.4 74.04,25.4
  Bottom 1.27: R14.2 68.96,26.67 70.23,25.4
N$54
  Bottom 0.61: 66.1,35.24 66.42,35.56 IC1.8
  Bottom 1.27: R14.1 R4.2 65.15,34.29 66.1,35.24
N$55
  Bottom 0.61: 63.88,43.18 65.15,41.91 IC1.13
  Bottom 0.813: 63.88,43.18 C5.+ 43.56,43.18 42.29,44.45 R10.E
  Bottom 1.27: R10.S 42.29,50.8 R10.E
N$56
  Bottom 0.813: R10.A 37.21,40.64 41.02,36.83 R5.1
N$57
  Bottom 0.406: 34.67,35.56 34.67,36.83
  Bottom 0.508: 34.67,36.83 34.67,40.64
  Bottom 1.27: T5.B 34.67,40.64 34.67,50.8 35.94,52.07 37.21,52.07 39.81,49.47 39.81,42.74 41.91,40.64 R17.2
N$58
  Bottom 0.61: R17.1 IC1.12
  Bottom 0.813: R5.2 R17.1
N$59
  Bottom 1.27: R6.1 95.63,39.52 R9.A
N$60
  Bottom 1.524: R7.1 83.31,44.35 R8.A
N$61
  Bottom 0.61: R7.2 79.98,44.2 77.7,41.91 IC1.2
  Bottom 1.524: R13.1 R7.2
N$62  (via drill 0.8)
  Top 0.813: v86.87,40.39 86.87,34.42 v86.74,34.29
  Bottom 0.508: 92.14,21.76 T3.1
  Bottom 0.61: 92.14,21.76 92.14,23.81
  Bottom 0.813: v86.87,40.39 R13.2
  Bottom 1.27: v86.74,34.29 92.14,28.89 92.14,23.81 T3.1
N$63
  Bottom 0.61: 78.23,44.68 76.73,43.18 IC1.1
  Bottom 0.813: R8.E 78.23,49.53 78.23,44.68
  Bottom 1.27: 78.23,52.07 78.23,53.47 | C3.+ 78.1,50.8 R8.E 78.99,50.93 79.12,50.8 | 78.23,52.07 76.96,50.8 78.23,49.53 79.12,50.42 79.12,50.8 | 78.23,52.07 79.12,51.18 79.12,50.8
  Bottom 1.524: R8.E 78.23,53.47 R8.S
N$64
  Bottom 0.61: IC1.6 89.13,36.83
  Bottom 1.27: R6.2 91.67,39.37 89.13,36.83 91.67,34.29 R16.1
N$65  (via drill 0.8)
  Top 0.61: v95.63,30.48 72.57,30.48 56.21,14.12 42.44,14.12 v41.02,12.7
  Bottom 0.813: v95.63,30.48 95.63,34.14 R16.2
  Bottom 1.27: T2.B 43.56,10.16 v41.02,12.7
N$66
  Bottom 0.61: 86.74,38.1 IC1.5
  Bottom 0.813: 89.28,40.64 86.74,38.1 | 99.06,52.45 99.06,52.07
  Bottom 1.27: C2.+ 99.06,29.59 99.06,52.07 95.25,55.88 R9.S 91.82,55.88 90.55,54.61 R9.E 90.55,41.91 89.28,40.64
N$67
  Bottom 0.813: LED1.A 27.37,49.84 R2.1
N$68
  Bottom 1.27: JP1.10 37.21,11.43 37.21,14.61
  Bottom 1.524: 37.21,14.61 T5.C
N$69
  Bottom 1.27: S2.1 15.49,42.09 J1.1
N$70
  pour Bottom: 52.02,52.12 52.04,52.08 52.07,52.03 52.09,51.98 52.11,51.94 52.14,51.89 52.19,51.8
N$71
  Bottom 0.508: 9.73,26.85 X1.1 11.76,26.85 12.57,26.04
  Bottom 0.61: 10.41,19.81 12.57,21.97 12.57,26.04
  Bottom 1.524: S2.3 10.41,19.81
N$72
  pour Bottom (isolate 2.54): 355 corners
N$74
  Bottom 1.27: JP1.6 51.18,7.62 54.99,7.62 60.07,12.7 60.07,16.51 57.53,19.05 T4.C
N$75
  pour Bottom (isolate 2.54): 84.57,9.54 84.34,9.6 84.29,9.61 84.3,9.56 84.32,9.51 84.35,9.45 84.37,9.4 84.39,9.35 84.42,9.3 84.45,9.25 84.48,9.21 84.51,9.17 84.54,9.13 84.57,9.09 84.6,9.06 84.64,9.02 84.68,8.99 84.71,8.96 84.75,8.94 84.79,8.91 84.83,8.89 84.87,8.87 84.91,8.85 84.95,8.83 84.99,8.82 85.03,8.8 85.08,8.79 85.12,8.78 85.16,8.78 85.21,8.77 85.25,8.77 85.3,8.77 85.34,8.77 85.39,8.77 85.43,8.77 85.48,8.78 85.52,8.79 85.57,8.8 85.61,8.81 85.66,8.82 85.7,8.84 85.75,8.85 85.79,8.87 85.83,8.89 85.88,8.91 85.92,8.94 85.96,8.96 86,8.99 86.04,9.02 86.08,9.04 86.12,9.08 86.16,9.11 86.2,9.14 86.15,9.16
N$76
  pour Bottom (isolate 2.54): 88.4,12.57 88.37,12.53 88.35,12.49 88.33,12.45 88.31,12.41 88.29,12.37 88.28,12.33 88.27,12.29 88.26,12.24 88.25,12.2 88.24,12.16 88.24,12.11 88.24,12.07 88.23,12.02 88.24,11.98 88.24,11.94 88.24,11.89 88.25,11.85 88.26,11.81 88.27,11.76 88.28,11.72 88.3,11.68 88.31,11.63 88.33,11.59 88.35,11.55 88.37,11.51 88.39,11.47 88.42,11.43 88.44,11.39 88.47,11.35 88.5,11.31 88.53,11.27 88.56,11.24 88.6,11.2 88.63,11.17 88.67,11.13 88.7,11.1 88.75,11.06 88.75,11.12 88.77,11.35 88.79,11.58 88.81,11.81 88.83,12.04 88.85,12.27 88.87,12.5 88.91,12.95 88.92,13.01 88.87,12.98 88.82,12.95 88.77,12.93 88.72,12.89 88.68,12.86 88.63,12.83 88.59,12.79 88.55,12.76 88.52,12.73 88.49,12.69 88.45,12.65 88.42,12.61
N$77
  Bottom 0.508: 92.58,18.54 93.09,19.05 | 93.34,18.54 92.58,18.54 | 92.33,18.29 92.58,18.54
  Bottom 0.61: T3.3 93.01,19.3 | 84.01,17.97 76.07,10.03
  Bottom 0.635: T3.3 93.09,19.05 92.33,18.29 | 92.01,17.97 92.77,17.97 93.34,18.54
  Bottom 0.813: 76.07,10.03 75.31,10.03 | 57.78,2.54 58.29,3.05
  Bottom 1.524: JP1.1 57.78,2.54 | 58.29,3.05 65.28,10.03 75.31,10.03 83.25,17.97 84.01,17.97 92.01,17.97
N$78
  pour Bottom (isolate 2.54): 89.37,11.73 89.37,11.68 89.37,11.64 89.37,11.59 89.37,11.55 89.37,11.5 89.37,11.46 89.38,11.41 89.39,11.36 89.4,11.32 89.41,11.27 89.42,11.23 89.44,11.18 89.45,11.14 89.47,11.09 89.49,11.05 89.51,11 89.54,10.96 89.56,10.91 89.59,10.87 89.61,10.92 89.89,11.55 89.98,11.76 90.08,11.98 90.17,12.19 90.26,12.4 90.35,12.61 90.37,12.66 90.32,12.65 90.26,12.64 90.21,12.63 90.16,12.62 90.1,12.6 90.05,12.58 90,12.56 89.95,12.54 89.91,12.52 89.87,12.5 89.82,12.47 89.78,12.44 89.75,12.42 89.71,12.39 89.67,12.36 89.64,12.32 89.61,12.29 89.58,12.26 89.56,12.22 89.53,12.18 89.51,12.15 89.49,12.11 89.46,12.07 89.45,12.03 89.43,11.99 89.42,11.95 89.4,11.9 89.39,11.86 89.38,11.82 89.38,11.77
N$79
  pour Bottom (isolate 2.54): 90.29,11.02 90.28,10.98 90.27,10.93 90.26,10.89 90.26,10.84 90.25,10.79 90.25,10.74 90.25,10.7 90.25,10.65 90.25,10.6 90.26,10.55 90.26,10.5 90.27,10.45 90.28,10.4 90.32,10.44 90.48,10.6 90.81,10.93 90.97,11.09 91.13,11.26 91.46,11.59 91.62,11.75 91.66,11.79 91.61,11.8 91.55,11.81 91.49,11.82 91.44,11.83 91.38,11.83 91.33,11.83 91.27,11.83 91.22,11.83 91.17,11.83 91.12,11.82 91.07,11.81 91.02,11.8 90.98,11.79 90.93,11.77 90.89,11.76 90.85,11.74 90.81,11.72 90.77,11.7 90.73,11.67 90.69,11.65 90.66,11.62 90.63,11.59 90.59,11.56 90.56,11.53 90.53,11.5 90.5,11.47 90.47,11.43 90.45,11.39 90.42,11.36 90.4,11.32 90.38,11.28 90.36,11.24 90.34,11.2 90.33,11.16 90.31,11.11 90.3,11.07
N$80
  pour Bottom (isolate 2.54): 87,12.25 86.99,12.2 86.98,12.16 86.98,12.11 86.97,12.07 86.97,12.02 86.97,11.98 86.98,11.94 86.98,11.89 86.99,11.85 87,11.81 87.01,11.76 87.03,11.72 87.04,11.68 87.06,11.64 87.08,11.6 87.1,11.56 87.12,11.53 87.17,11.45 87.2,11.42 87.22,11.38 87.25,11.35 87.28,11.32 87.32,11.28 87.35,11.25 87.39,11.22 87.42,11.19 87.46,11.17 87.5,11.14 87.54,11.12 87.58,11.09 87.63,11.07 87.67,11.05 87.71,11.03 87.76,11.01 87.81,10.99 87.86,10.97 87.84,11.03 87.78,11.25 87.72,11.47 87.59,11.91 87.53,12.13 87.34,12.78 87.32,12.83 87.29,12.8 87.25,12.75 87.22,12.71 87.18,12.66 87.15,12.62 87.12,12.57 87.1,12.52 87.07,12.48 87.05,12.43 87.04,12.39 87.02,12.34 87.01,12.29
N$81
  pour Bottom (isolate 2.54): 85.92,12.12 85.9,12.08 85.88,12.02 85.86,11.96 85.84,11.91 85.83,11.86 85.82,11.8 85.81,11.75 85.8,11.7 85.8,11.65 85.8,11.6 85.8,11.55 85.8,11.5 85.8,11.45 85.81,11.4 85.82,11.36 85.83,11.31 85.84,11.27 85.86,11.22 85.87,11.18 85.89,11.14 85.91,11.1 85.93,11.06 85.96,11.03 85.98,10.99 86.01,10.95 86.04,10.92 86.07,10.89 86.1,10.86 86.13,10.83 86.16,10.8 86.2,10.77 86.24,10.74 86.28,10.72 86.31,10.69 86.35,10.67 86.4,10.65 86.48,10.61 86.52,10.6 86.57,10.58 86.61,10.57 86.66,10.56 86.71,10.55 86.76,10.54 86.81,10.53 86.86,10.52 86.9,10.52 86.95,10.52 87.06,10.52 87.03,10.56 86.89,10.75 86.76,10.94 86.62,11.13 86.49,11.32 86.35,11.51 86.09,11.89 85.95,12.08
N$82
  pour Bottom (isolate 2.54): 84.92,10.63 84.93,10.58 84.94,10.53 84.96,10.48 84.98,10.43 85,10.39 85.02,10.34 85.04,10.3 85.07,10.26 85.09,10.22 85.12,10.19 85.15,10.15 85.18,10.12 85.21,10.09 85.24,10.05 85.28,10.03 85.31,10 85.35,9.97 85.39,9.95 85.43,9.93 85.47,9.91 85.51,9.89 85.55,9.87 85.59,9.86 85.68,9.83 85.72,9.82 85.77,9.81 85.81,9.81 85.86,9.8 85.91,9.8 85.95,9.79 86,9.79 86.05,9.8 86.09,9.8 86.14,9.8 86.19,9.81 86.24,9.82 86.29,9.83 86.34,9.84 86.38,9.85 86.43,9.87 86.48,9.89 86.53,9.91 86.48,9.94 86.29,10.07 85.13,10.86 84.93,10.99 84.89,11.02 84.89,10.97 84.89,10.9 84.89,10.85 84.89,10.79 84.9,10.73 84.91,10.68
N$83
  Bottom 1.27: JP1.7 JP1.8 46.1,6.35 48.64,8.89 T2.C
VCC
  Bottom 0.406: 46.48,45.97 48.01,44.45 52.7,44.45
  Bottom 0.508: 58.8,44.45 52.7,44.45
  Bottom 0.61: IC1.14 65.66,43.18 64.39,44.45 58.8,44.45
  Bottom 0.813: JP1.9 42.54,2.54 31.24,13.84 S1.1
  Bottom 1.27: 46.48,45.97 44.7,47.75 44.7,52.7 41.27,56.13 33.66,56.13 31.24,53.72 S1.1

### Text on the board
Bottom: Mateusz Świątek | Adam Kołodyński | 3TN